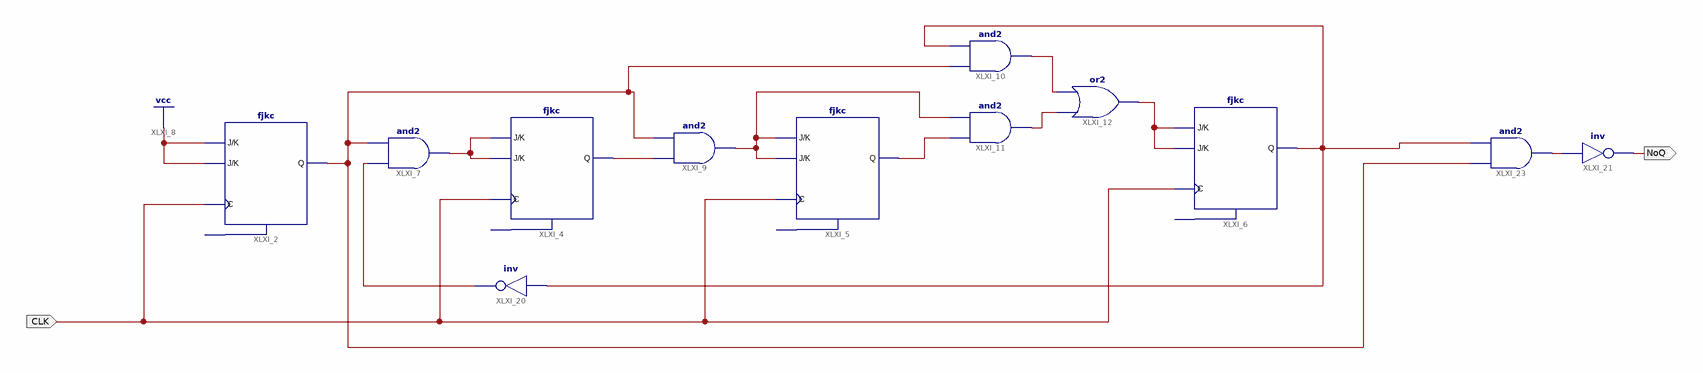
[diagram p0: schematic sheet 1]
// Xilinx ISE schematic Contador10S2.sch (spartan3e) as structural Verilog: 12 symbols, 2 ports
module Contador10S2 (
  input  CLK,
  output NoQ
);

  wire XLXN_6, XLXN_7, XLXN_8, XLXN_13, XLXN_21, XLXN_35, XLXN_36, XLXN_39, XLXN_42, XLXN_49, XLXN_53;

  fjkc XLXI_2 (.C(CLK), .J(1'b1), .K(1'b1), .Q(XLXN_39));  // open: CLR
  and XLXI_7 (XLXN_6, XLXN_36, XLXN_39);
  fjkc XLXI_4 (.C(CLK), .J(XLXN_6), .K(XLXN_6), .Q(XLXN_53));  // open: CLR
  and XLXI_9 (XLXN_13, XLXN_53, XLXN_39);
  and XLXI_11 (XLXN_7, XLXN_35, XLXN_13);
  or XLXI_12 (XLXN_21, XLXN_7, XLXN_8);
  fjkc XLXI_5 (.C(CLK), .J(XLXN_13), .K(XLXN_13), .Q(XLXN_35));  // open: CLR
  and XLXI_10 (XLXN_8, XLXN_39, XLXN_49);
  fjkc XLXI_6 (.C(CLK), .J(XLXN_21), .K(XLXN_21), .Q(XLXN_49));  // open: CLR
  not XLXI_20 (XLXN_36, XLXN_49);
  not XLXI_21 (NoQ, XLXN_42);
  and XLXI_23 (XLXN_42, XLXN_39, XLXN_49);
endmodule
